# EAGLE design LED_driver (EAGLE 6.4)
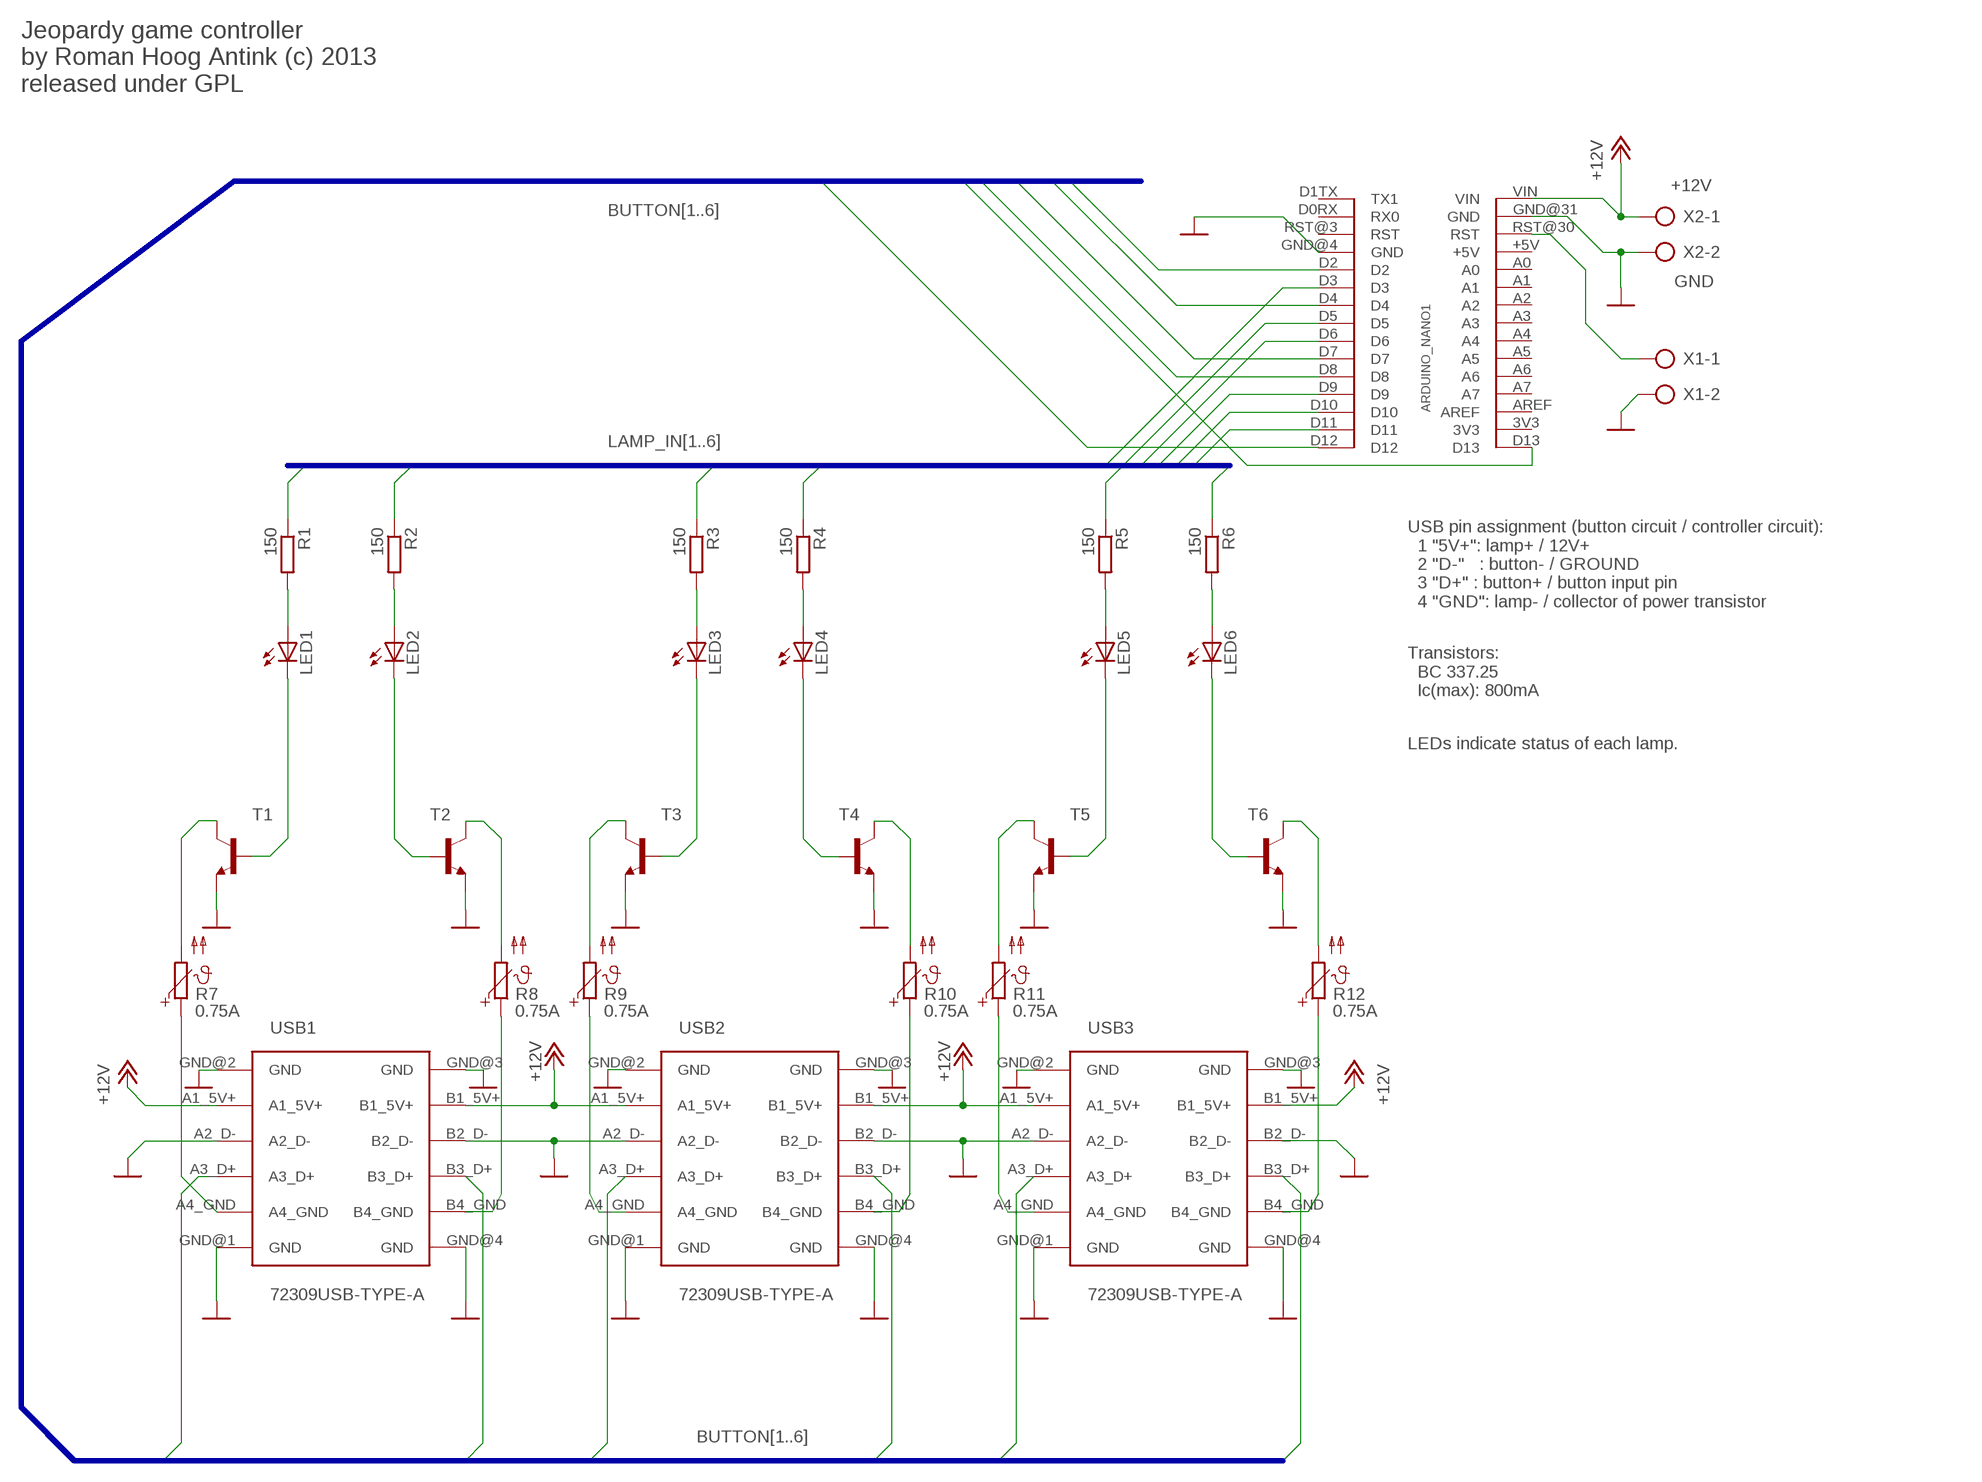
[diagram p0: schematic, sheet 1]

## Parts
ARDUINO_NANO1  ARDUINO-NANO-SHIELD-CON  [ARDUINO-NANO-SHIELD-CON]
LED1  LED3MM  [LED3MM]
LED2  LED3MM  [LED3MM]
LED3  LED3MM  [LED3MM]
LED4  LED3MM  [LED3MM]
LED5  LED3MM  [LED3MM]
LED6  LED3MM  [LED3MM]
R1  150  R-EU_0207/10  [0207/10]
R2  150  R-EU_0207/10  [0207/10]
R3  150  R-EU_0207/10  [0207/10]
R4  150  R-EU_0207/10  [0207/10]
R5  150  R-EU_0207/10  [0207/10]
R6  150  R-EU_0207/10  [0207/10]
R7  0.75A  PTCRXEF075_TYCO  [PTC]
R8  0.75A  PTCRXEF075_TYCO  [PTC]
R9  0.75A  PTCRXEF075_TYCO  [PTC]
R10  0.75A  PTCRXEF075_TYCO  [PTC]
R11  0.75A  PTCRXEF075_TYCO  [PTC]
R12  0.75A  PTCRXEF075_TYCO  [PTC]
T1  -NPN-TO92  [TO92]
T2  -NPN-TO92  [TO92]
T3  -NPN-TO92  [TO92]
T4  -NPN-TO92  [TO92]
T5  -NPN-TO92  [TO92]
T6  -NPN-TO92  [TO92]
USB1  72309USB-TYPE-A  [72309]
USB2  72309USB-TYPE-A  [72309]
USB3  72309USB-TYPE-A  [72309]
X1  AK300/2  [AK300/2]
X2  AK300/2  [AK300/2]

## Nets
+12V [high_power]: ARDUINO_NANO1.VIN USB1.A1_5V+ USB1.B1_5V+ USB2.A1_5V+ USB2.B1_5V+ USB3.A1_5V+ USB3.B1_5V+ X2.1
BUTTON1: ARDUINO_NANO1.D2 USB1.A3_D+
BUTTON2: ARDUINO_NANO1.D4 USB1.B3_D+
BUTTON3: ARDUINO_NANO1.D7 USB2.A3_D+
BUTTON4: ARDUINO_NANO1.D8 USB2.B3_D+
BUTTON5: ARDUINO_NANO1.D12 USB3.A3_D+
BUTTON6: ARDUINO_NANO1.D13 USB3.B3_D+
GND [high_power]: ARDUINO_NANO1.GND@4(GND) ARDUINO_NANO1.GND@31(GND) T1.1(E) T2.1(E) T3.1(E) T4.1(E) T5.1(E) T6.1(E) USB1.A2_D- USB1.B2_D- USB1.GND@1(GND) USB1.GND@2(GND) USB1.GND@3(GND) USB1.GND@4(GND) USB2.A2_D- USB2.B2_D- USB2.GND@1(GND) USB2.GND@2(GND) USB2.GND@3(GND) USB2.GND@4(GND) USB3.A2_D- USB3.B2_D- USB3.GND@1(GND) USB3.GND@2(GND) USB3.GND@3(GND) USB3.GND@4(GND) X1.2 X2.2
LAMP_IN1: ARDUINO_NANO1.D3 R1.1
LAMP_IN2: ARDUINO_NANO1.D5 R2.1
LAMP_IN3: ARDUINO_NANO1.D6 R3.1
LAMP_IN4: ARDUINO_NANO1.D9 R4.1
LAMP_IN5: ARDUINO_NANO1.D10 R5.1
LAMP_IN6: ARDUINO_NANO1.D11 R6.1
N$1: LED6.A R6.2
N$2 [high_power]: R7.2 T1.3(C)
N$3 [high_power]: R8.1 USB1.B4_GND
N$4 [high_power]: R9.1 USB2.A4_GND
N$5 [high_power]: R10.2 T4.3(C)
N$6 [high_power]: R11.1 USB3.A4_GND
N$7: LED1.K(C) T1.2(B)
N$8: LED2.K(C) T2.2(B)
N$9: LED3.K(C) T3.2(B)
N$10: LED4.K(C) T4.2(B)
N$11: LED5.K(C) T5.2(B)
N$12: LED6.K(C) T6.2(B)
N$13 [high_power]: R12.2 T6.3(C)
N$14: LED5.A R5.2
N$15: LED4.A R4.2
N$17: LED3.A R3.2
N$18: LED2.A R2.2
N$19: LED1.A R1.2
N$20: ARDUINO_NANO1.RST@30(RST) X1.1
N$21 [high_power]: R7.1 USB1.A4_GND
N$22 [high_power]: R8.2 T2.3(C)
N$23 [high_power]: R9.2 T3.3(C)
N$24 [high_power]: R10.1 USB2.B4_GND
N$25 [high_power]: R11.2 T5.3(C)
N$26 [high_power]: R12.1 USB3.B4_GND
Unconnected: ARDUINO_NANO1.3V3 ARDUINO_NANO1.+5V ARDUINO_NANO1.A0 ARDUINO_NANO1.A1 ARDUINO_NANO1.A2 ARDUINO_NANO1.A3 ARDUINO_NANO1.A4 ARDUINO_NANO1.A5 ARDUINO_NANO1.A6 ARDUINO_NANO1.A7 ARDUINO_NANO1.AREF ARDUINO_NANO1.D0RX(RX0) ARDUINO_NANO1.D1TX(TX1) ARDUINO_NANO1.RST@3(RST)

## Buses
BUTTON[1..6]
LAMP_IN[1..6]

## Notes on the sheet
- Jeopardy game controller
  by Roman Hoog Antink (c) 2013
  released under GPL
- USB pin assignment (button circuit / controller circuit):
    1 "5V+": lamp+ / 12V+
    2 "D-"   : button- / GROUND
    3 "D+" : button+ / button input pin
    4 "GND": lamp- / collector of power transistor
- Transistors:
    BC 337.25
    Ic(max): 800mA
- LEDs indicate status of each lamp.

## Library data of the parts
ARDUINO_NANO1 = contrib-con-misc:ARDUINO-NANO-SHIELD-CON: Shield connector layout for the Arduino Nano (2 rows with 15pins each) Pin spacing is 0.1 inch.
LED1-LED6 = led:LED: LED OSRAM: - CHIPLED LG R971, LG N971, LY N971, LG Q971, LY Q971, LO R971, LY R971 LH N974, LH R974 LS Q976, LO Q976, LY Q976 LO Q996 - Hyper CHIPLED LW Q18S LB Q993, LB Q99A, LB R99A - SideLED LS A670, LO A670, LY A670, LG A670, LP A670 LB A673, LV A673, LT A673, LW A673 LH A674 LY A675 LS A676, LA A676, LO A676, LY A676, LW A676 LS A679, LY A679, LG A679 - Hyper Micro SIDELED® LS Y876, LA Y876, LO Y876, LY Y876 LT Y87S - SmartLED LW L88C, LW L88S LB L89C, LB L89S, LG L890 LS L89K, LO L89K, LY L89K LS L896, LA L896, LO L896, LY L896 - TOPLED LS T670, LO T670, LY T670, LG T670, LP T670 LSG T670, LSP T670, LSY T670, LOP T670, LYG T670 LG T671, LOG T671, LSG T671 LB T673, LV T673, LT T673, LW T673 LH T674 LS T676, LA T676, LO T676, LY T676, LB T676, LH T676, LSB T676, LW T676 LB T67C, LV T67C, LT T67C, LS T67K, LO T67K, LY T67K, LW E67C LS E67B, LA E67B, LO E67B, LY E67B, LB E67C, LV E67C, LT E67C LW T67C LS T679, LY T679, LG T679 LS T770, LO T770, LY T770, LG T770, LP T770 LB T773, LV T773, LT T773, LW T773 LH T774 LS E675, LA E675, LY E675, LS T675 LS T776, LA T776, LO T776, LY T776, LB T776 LHGB T686 LT T68C, LB T68C - Hyper Mini TOPLED® LB M676 - Mini TOPLED Santana® LG M470 LS M47K, LO M47K, LY M47K Source: http://www.osram.convergy.de LUXEON: - LUMILED® LXK2-PW12-R00, LXK2-PW12-S00, LXK2-PW14-U00, LXK2-PW14-V00 LXK2-PM12-R00, LXK2-PM12-S00, LXK2-PM14-U00 LXK2-PE12-Q00, LXK2-PE12-R00, LXK2-PE12-S00, LXK2-PE14-T00, LXK2-PE14-U00 LXK2-PB12-K00, LXK2-PB12-L00, LXK2-PB12-M00, LXK2-PB14-N00, LXK2-PB14-P00, LXK2-PB14-Q00 LXK2-PR12-L00, LXK2-PR12-M00, LXK2-PR14-Q00, LXK2-PR14-R00 LXK2-PD12-Q00, LXK2-PD12-R00, LXK2-PD12-S00 LXK2-PH12-R00, LXK2-PH12-S00 LXK2-PL12-P00, LXK2-PL12-Q00, LXK2-PL12-R00 Source: www.luxeon.com KINGBRIGHT: KA-3528ASYC Source: www.kingbright.com
R1-R6 = resistor:R-EU_: RESISTOR, European symbol
R7-R12 = contrib-con-misc:PTC: Polyswitch PTC TYCO RXE075
T1-T6 = transistor:*-NPN-: NPN Transistror BF959 corrected 2008.03.06
USB1-USB3 = contrib-con-misc:72309: Dual USB connector receptacle, female, type A, through hole
X1 X2 = con-ptr500:AK300/2: CONNECTOR; OC_FARNELL: unknown; OC_NEWARK: unknown

## Net classes
0 default: width 0.254 mm
1 high_power: width 0.254 mm

## Board
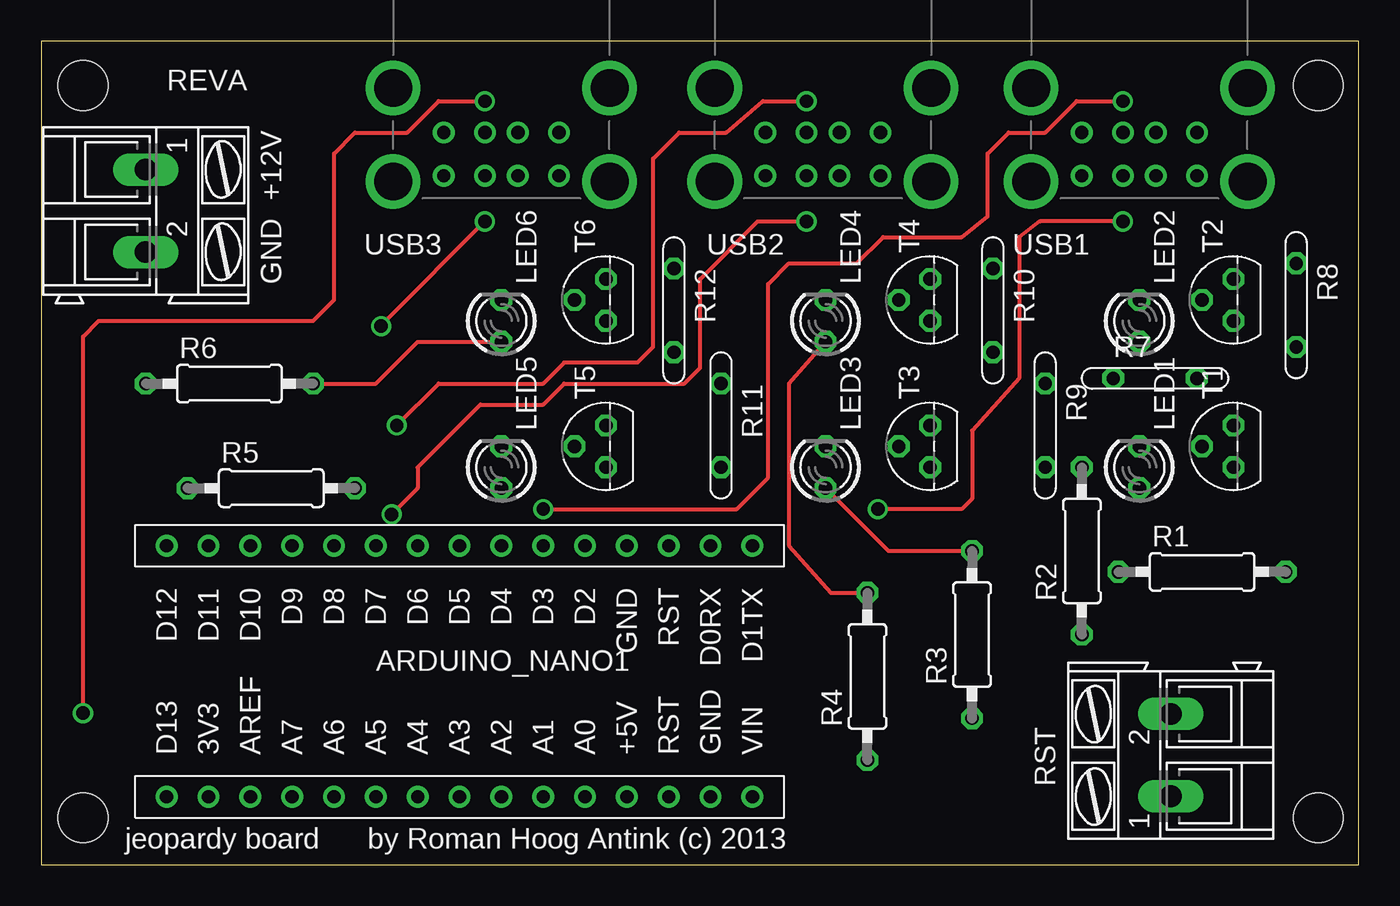
[diagram p1: board, top side]
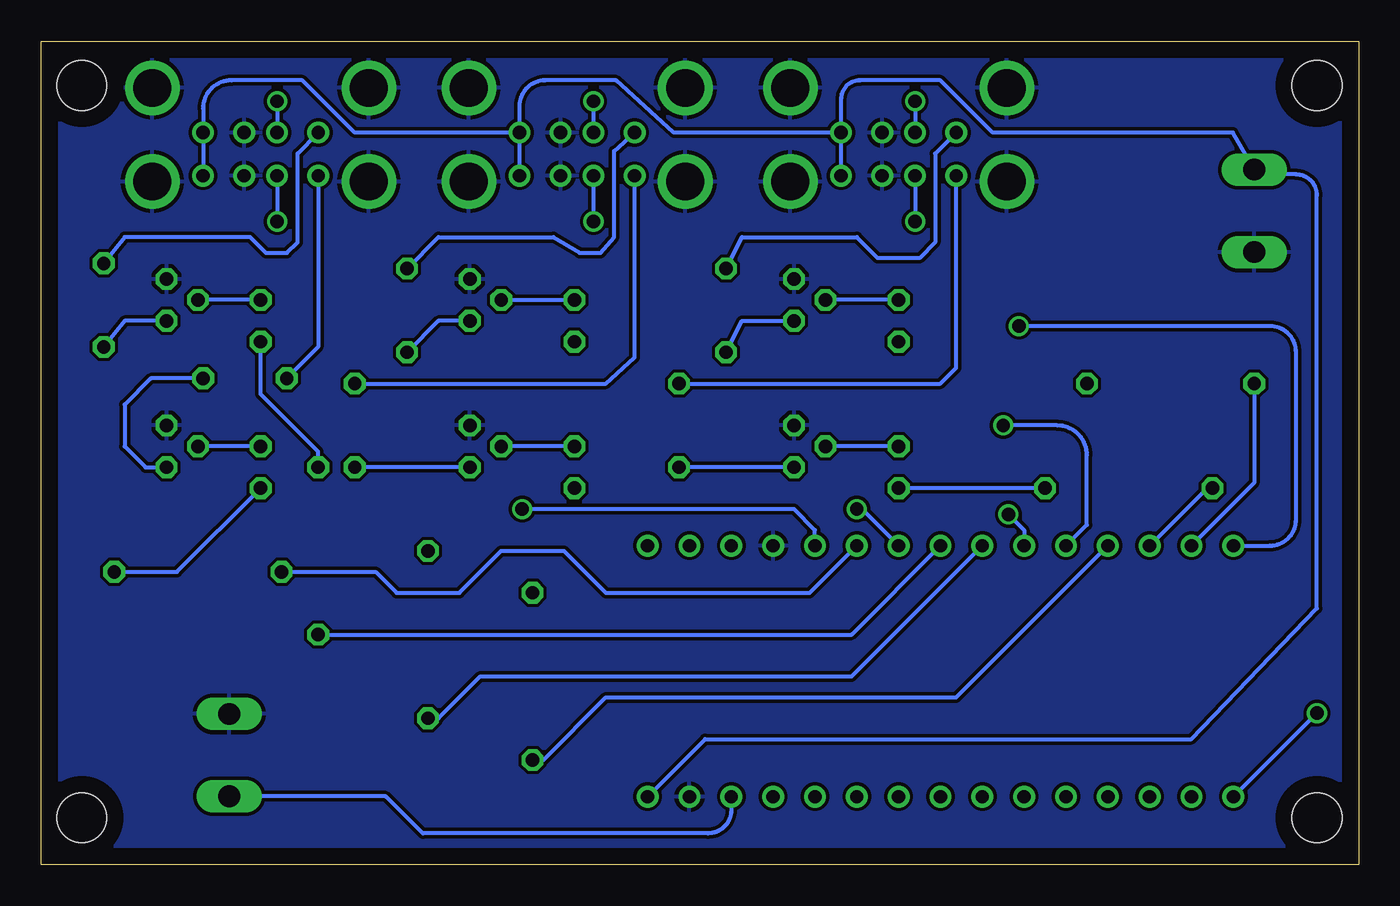
[diagram p2: board, bottom side, seen from below]

Size 80 x 50 mm. Coordinates in mm from the lower left corner, seen from the top.
Outline: 0,0 80,0 80,50 0,50 0,0
Copper layers (1*16): Top 0.035mm / dielectric 1.5mm / Bottom 0.035mm
Design rules "default": minimum track width 10mil, minimum drill 24mil, track to track 8mil, track to pad 8mil, pad to pad 8mil, via to via 8mil, smd to smd 8mil, copper to edge 40mil, drill to drill 8mil, minimum pad ring 10mil, minimum via ring 8mil, stop-mask expansion 4mil, vias tented up to drill 0mil, thermal gap 10mil
Holes 3 mm at 2.54,47.31 77.53,47.31 77.53,2.86 2.54,2.86

### Footprints (pad centres in the part's own frame; a part is rotated, then mirrored left to right if it is on the bottom)
ARDUINO-NANO-SHIELD-CON = drill 0.813: 3V3 -12.7,-7.62; +5V 12.7,-7.62; A0 10.16,-7.62; A1 7.62,-7.62; A2 5.08,-7.62; A3 2.54,-7.62; A4 0,-7.62; A5 -2.54,-7.62; A6 -5.08,-7.62; A7 -7.62,-7.62; AREF -10.16,-7.62; D0RX 17.78,7.62; D1TX 20.32,7.62; D2 10.16,7.62; D3 7.62,7.62; D4 5.08,7.62; D5 2.54,7.62; D6 0,7.62; D7 -2.54,7.62; D8 -5.08,7.62; D9 -7.62,7.62; D10 -10.16,7.62; D11 -12.7,7.62; D12 -15.24,7.62; D13 -15.24,-7.62; GND@4 12.7,7.62; GND@31 17.78,-7.62; RST@3 15.24,7.62; RST@30 15.24,-7.62; VIN 20.32,-7.62
LED3MM = drill 0.813 octagon: A -1.27,0; K 1.27,0
0207/10 = drill 0.813 octagon: 1 -5.08,0; 2 5.08,0
PTC = drill 0.813 octagon: 1 -2.54,0; 2 2.54,0
TO92 = drill 0.813 octagon: 1 1.27,0; 2 0,1.905; 3 -1.27,0
72309 = drill 0.813: A1_5V+ -3.5,2.62; A2_D- -1,2.62; A3_D+ 1,2.62; A4_GND 3.5,2.62; B1_5V+ -3.5,0; B2_D- -1,0; B3_D+ 1,0; B4_GND 3.5,0 | drill 2.3: GND@1 -6.57,2.97; GND@2 -6.57,-2.71; GND@3 6.57,-2.71; GND@4 6.57,2.97
AK300/2 = drill 1.321 long: 1 -2.515,0; 2 2.489,0

### Placement (x,y rotation side)
ARDUINO_NANO1  22.86,11.75 0 top
LED1  66.67,24.13 90 top
LED2  66.67,33.02 90 top
LED3  47.62,24.13 90 top
LED4  47.62,33.02 90 top
LED5  27.94,24.13 90 top
LED6  27.94,33.02 90 top
R1  70.48,17.78 0 top
R2  63.18,19.05 90 top
R3  56.52,13.97 90 top
R4  50.16,11.43 90 top
R5  13.97,22.86 0 top
R6  11.43,29.21 0 top
R7  67.63,29.53 0 top
R8  76.2,33.97 270 top
R9  60.96,26.67 270 top
R10  57.78,33.66 270 top
R11  41.27,26.67 270 top
R12  38.42,33.66 270 top
T1  72.39,25.4 90 top
T2  72.39,34.29 90 top
T3  53.98,25.4 90 top
T4  53.98,34.29 90 top
T5  34.29,25.4 90 top
T6  34.29,34.29 90 top
USB1  66.67,44.45 180 top
USB2  47.47,44.45 180 top
USB3  27.94,44.45 180 top
X1  68.58,6.67 90 top
X2  6.35,39.69 270 top

### Tracks (layer width: path | path; a pad name or v marks a point on that pad's centre or on a via)
+12V
  Bottom 0.254: USB3.B1_5V+ 31.44,46.47 arc90 30.29,47.62 25.4,47.62 22.23,44.45 7.64,44.45 X2.1 6.33,41.91 3.81,41.91 arc90 2.54,40.64 2.54,15.56 10.16,7.62 39.69,7.62 ARDUINO_NANO1.VIN | USB3.B1_5V+ USB3.A1_5V+ | USB3.B1_5V+ 41.59,44.45 45.09,47.62 49.4,47.62 arc-90 50.97,46.05 USB2.B1_5V+ | USB2.B1_5V+ USB2.A1_5V+ | USB2.B1_5V+ 60.96,44.45 64.14,47.62 68.46,47.62 arc-90 70.17,45.91 USB1.B1_5V+ USB1.A1_5V+
BUTTON1  (via drill 0.81)
  Top 0.254: v50.8,21.59 55.88,21.59 56.52,22.23 56.52,26.35 59.37,29.53 59.37,38.1 60.64,39.05 v65.67,39.05
  Bottom 0.254: ARDUINO_NANO1.D2 33.02,20.32 34.29,21.59 v50.8,21.59 | USB1.A3_D+ v65.67,39.05
BUTTON2  (via drill 0.81)
  Top 0.254: v65.67,46.35 62.87,46.35 60.96,44.45 58.74,44.45 57.47,43.18 57.47,39.37 55.88,38.1 51.12,38.1 49.53,36.51 45.4,36.51 44.13,35.24 44.13,23.5 42.23,21.59 v30.48,21.59
  Bottom 0.254: ARDUINO_NANO1.D4 30.16,21.59 v30.48,21.59 | v65.67,46.35 USB1.B3_D+
BUTTON3  (via drill 0.81)
  Top 0.254: v46.47,39.05 43.5,39.05 40.01,35.56 40.01,30.16 39.05,29.21 31.75,29.21 30.48,27.94 26.67,27.94 22.86,24.13 22.86,22.86 v21.27,21.27
  Bottom 0.254: USB2.A3_D+ v46.47,39.05 | v21.27,21.27 20.32,20.32 ARDUINO_NANO1.D7
BUTTON4  (via drill 0.81)
  Top 0.254: v46.47,46.35 43.81,46.35 41.59,44.45 38.73,44.45 37.15,42.86 37.15,31.43 36.2,30.48 31.75,30.48 30.48,29.21 24.13,29.21 v21.59,26.67
  Bottom 0.254: v21.59,26.67 18.31,26.67 arc90 16.51,24.87 16.51,20.64 ARDUINO_NANO1.D8 | v46.47,46.35 USB2.B3_D+
BUTTON5  (via drill 0.81)
  Top 0.254: v20.64,32.7 20.95,33.07 v26.94,39.05
  Bottom 0.254: ARDUINO_NANO1.D12 5.4,19.37 arc-90 3.81,20.95 3.81,31.11 arc-90 5.4,32.7 v20.64,32.7 | USB3.A3_D+ v26.94,39.05
BUTTON6  (via drill 0.81)
  Top 0.254: v26.94,46.35 24.13,46.35 22.23,44.45 19.05,44.45 17.78,43.18 17.78,34.29 16.51,33.02 3.49,33.02 2.54,32.07 v2.54,9.21
  Bottom 0.254: v26.94,46.35 USB3.B3_D+ | ARDUINO_NANO1.D13 v2.54,9.21
GND
  pour Bottom: 0.32,49.53 79.44,49.53 79.44,0.64 0.32,0.64
LAMP_IN1
  Bottom 0.254: R1.1 59.69,17.78 58.42,16.51 54.61,16.51 52.07,19.05 48.26,19.05 45.72,16.51 33.34,16.51 ARDUINO_NANO1.D3
LAMP_IN2
  Bottom 0.254: R2.1 30.8,13.97 ARDUINO_NANO1.D5
LAMP_IN3
  Bottom 0.254: R3.1 55.88,8.89 53.34,11.43 30.8,11.43 ARDUINO_NANO1.D6
LAMP_IN4
  Bottom 0.254: R4.1 49.53,6.35 45.72,10.16 24.45,10.16 ARDUINO_NANO1.D9
LAMP_IN5
  Bottom 0.254: R5.1 9.21,22.86 ARDUINO_NANO1.D10
LAMP_IN6
  Bottom 0.254: R6.1 6.35,23.18 ARDUINO_NANO1.D11
N$1
  Top 0.254: R6.2 20.32,29.21 22.86,31.75 LED6.A
N$2
  Bottom 0.254: R7.2 73.34,29.53 74.93,27.94 74.93,25.4 73.66,24.13 T1.3
N$3
  Bottom 0.254: USB1.B4_GND 64.42,43.17 64.42,37.78 65.09,37.15 66.36,37.15 67.31,38.1 74.93,38.1 R8.1
N$4
  Bottom 0.254: R9.1 45.72,29.21 43.97,30.8 USB2.A4_GND
N$5
  Bottom 0.254: T4.3 55.88,33.02 R10.2
N$6
  Bottom 0.254: R11.1 25.4,29.21 24.45,30.16 USB3.A4_GND
N$7
  Bottom 0.254: LED1.K T1.2
N$8
  Bottom 0.254: LED2.K T2.2
N$9
  Bottom 0.254: LED3.K T3.2
N$10
  Bottom 0.254: T4.2 LED4.K
N$11
  Bottom 0.254: LED5.K T5.2
N$12
  Bottom 0.254: LED6.K T6.2
N$13
  Bottom 0.254: R12.2 37.47,33.02 T6.3
N$14
  Bottom 0.254: R5.2 LED5.A
N$15
  Top 0.254: R4.2 47.94,16.51 45.4,19.37 45.4,29.21 LED4.A
N$17
  Top 0.254: LED3.A 51.44,19.05 R3.2
N$18
  Bottom 0.254: R2.2 63.18,25.08 66.67,28.57 LED2.A
N$19
  Bottom 0.254: R1.2 71.75,17.78 LED1.A
N$20
  Bottom 0.254: X1.1 59.08,4.15 56.83,1.91 39.52,1.91 arc-90 38.1,3.33 ARDUINO_NANO1.RST@30
N$21
  Bottom 0.254: USB1.A4_GND 63.18,41.82 63.18,31.43 R7.1
N$22
  Bottom 0.254: T2.3 74.93,33.02 R8.2
N$23
  Bottom 0.254: T3.3 R9.2
N$24
  Bottom 0.254: USB2.B4_GND 45.22,43.33 45.22,38.1 46.04,37.15 47.31,37.15 48.9,38.1 55.88,38.1 R10.1
N$25
  Bottom 0.254: T5.3 R11.2
N$26
  Bottom 0.254: USB3.B4_GND 25.72,43.17 25.72,37.78 26.67,36.83 29.21,36.83 30.48,38.1 37.47,38.1 R12.1

### Text on the board
tPlace: REVA | +12V | GND | RST | jeopardy board by Roman Hoog Antink (c) 2013